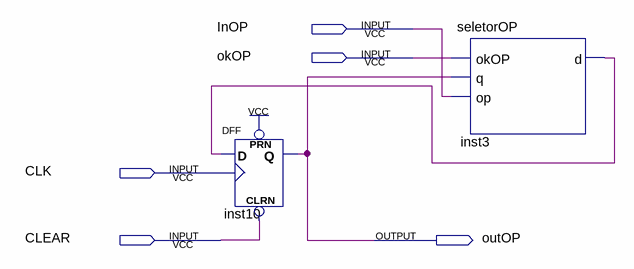
[diagram p0: schematic sheet]
// Quartus schematic memop.bdf as structural Verilog: 2 symbols, 5 pins
module memop (
  input  InOP,
  input  okOP,
  input  CLK,
  input  CLEAR,
  output outOP
);

  wire inst3_d;

  DFF inst10 (.CLRN(CLEAR), .CLK(CLK), .D(inst3_d), .PRN(1'b1), .Q(outOP));
  seletorOP inst3 (.okOP(okOP), .q(outOP), .op(InOP), .d(inst3_d));
endmodule
